# EAGLE design teensy_relay_controller (EAGLE 6.4)
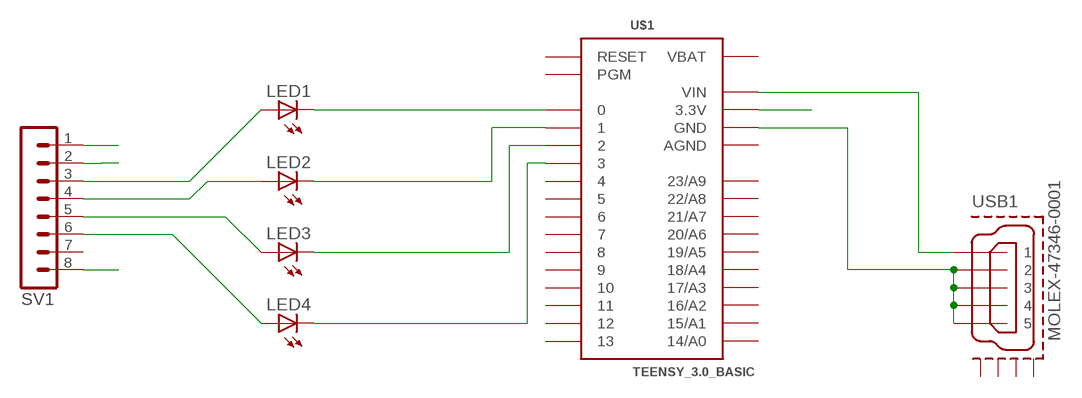
[diagram p0: schematic, sheet 1]

## Parts
LED1  LED5MM  [LED5MM]
LED2  LED5MM  [LED5MM]
LED3  LED5MM  [LED5MM]
LED4  LED5MM  [LED5MM]
SV1  MA08-1  [MA08-1]
U$1  TEENSY_3.0_BASIC  [TEENSY_3.0_BASIC]
USB1  MOLEX-47346-0001  [MOLEX-47364-0001]

## Nets
3.3V_VCC: SV1.2 U$1.3.3V U$1.3.3V1(3.3V)
5V_VCC: SV1.1 U$1.VIN USB1.1
_RELAY3: LED2.A SV1.4
_RELAY4: LED1.K(C) U$1.0
GND: SV1.8 U$1.GND U$1.GND1(GND) USB1.2 USB1.3 USB1.4 USB1.5
N$2: LED2.K(C) U$1.1
N$3: LED3.K(C) U$1.2
N$4: LED4.K(C) U$1.3
N$5: LED1.A SV1.3
N$6: LED3.A SV1.5
N$7: LED4.A SV1.6
Unconnected: SV1.7 U$1.4 U$1.5 U$1.6 U$1.7 U$1.8 U$1.9 U$1.10 U$1.11 U$1.12 U$1.13 U$1.14/A0 U$1.15/A1 U$1.16/A2 U$1.17/A3 U$1.18/A4 U$1.19/A5 U$1.20/A6 U$1.21/A7 U$1.22/A8 U$1.23/A9 U$1.PGM U$1.RESET USB1.GND1 USB1.GND2 USB1.GND3 USB1.GND4

## Power pins joined to a net without a drawn wire
AGND: U$1.AGND
VBAT: U$1.VBAT

## Library data of the parts
LED1-LED4 = led:LED: LED OSRAM: - CHIPLED LG R971, LG N971, LY N971, LG Q971, LY Q971, LO R971, LY R971 LH N974, LH R974 LS Q976, LO Q976, LY Q976 LO Q996 - Hyper CHIPLED LW Q18S LB Q993, LB Q99A, LB R99A - SideLED LS A670, LO A670, LY A670, LG A670, LP A670 LB A673, LV A673, LT A673, LW A673 LH A674 LY A675 LS A676, LA A676, LO A676, LY A676, LW A676 LS A679, LY A679, LG A679 - Hyper Micro SIDELED® LS Y876, LA Y876, LO Y876, LY Y876 LT Y87S - SmartLED LW L88C, LW L88S LB L89C, LB L89S, LG L890 LS L89K, LO L89K, LY L89K LS L896, LA L896, LO L896, LY L896 - TOPLED LS T670, LO T670, LY T670, LG T670, LP T670 LSG T670, LSP T670, LSY T670, LOP T670, LYG T670 LG T671, LOG T671, LSG T671 LB T673, LV T673, LT T673, LW T673 LH T674 LS T676, LA T676, LO T676, LY T676, LB T676, LH T676, LSB T676, LW T676 LB T67C, LV T67C, LT T67C, LS T67K, LO T67K, LY T67K, LW E67C LS E67B, LA E67B, LO E67B, LY E67B, LB E67C, LV E67C, LT E67C LW T67C LS T679, LY T679, LG T679 LS T770, LO T770, LY T770, LG T770, LP T770 LB T773, LV T773, LT T773, LW T773 LH T774 LS E675, LA E675, LY E675, LS T675 LS T776, LA T776, LO T776, LY T776, LB T776 LHGB T686 LT T68C, LB T68C - Hyper Mini TOPLED® LB M676 - Mini TOPLED Santana® LG M470 LS M47K, LO M47K, LY M47K Source: http://www.osram.convergy.de LUXEON: - LUMILED® LXK2-PW12-R00, LXK2-PW12-S00, LXK2-PW14-U00, LXK2-PW14-V00 LXK2-PM12-R00, LXK2-PM12-S00, LXK2-PM14-U00 LXK2-PE12-Q00, LXK2-PE12-R00, LXK2-PE12-S00, LXK2-PE14-T00, LXK2-PE14-U00 LXK2-PB12-K00, LXK2-PB12-L00, LXK2-PB12-M00, LXK2-PB14-N00, LXK2-PB14-P00, LXK2-PB14-Q00 LXK2-PR12-L00, LXK2-PR12-M00, LXK2-PR14-Q00, LXK2-PR14-R00 LXK2-PD12-Q00, LXK2-PD12-R00, LXK2-PD12-S00 LXK2-PH12-R00, LXK2-PH12-S00 LXK2-PL12-P00, LXK2-PL12-Q00, LXK2-PL12-R00 Source: www.luxeon.com KINGBRIGHT: KA-3528ASYC Source: www.kingbright.com
SV1 = con-lstb:MA08-1: PIN HEADER; OC_FARNELL: unknown; OC_NEWARK: unknown
U$1 = Teensy3.0:TEENSY_3.0_BASIC: Basic Teensy 3.0 with none of the 'inner' pins enabled. See '+4', 'AllAnalogPins", and 'AllPins' packages for additional pin holes, as needed.
USB1 = usb_con-update:MOLEX-47346-0001: MICRO USB B, BOTTOM MOUNT

## Board
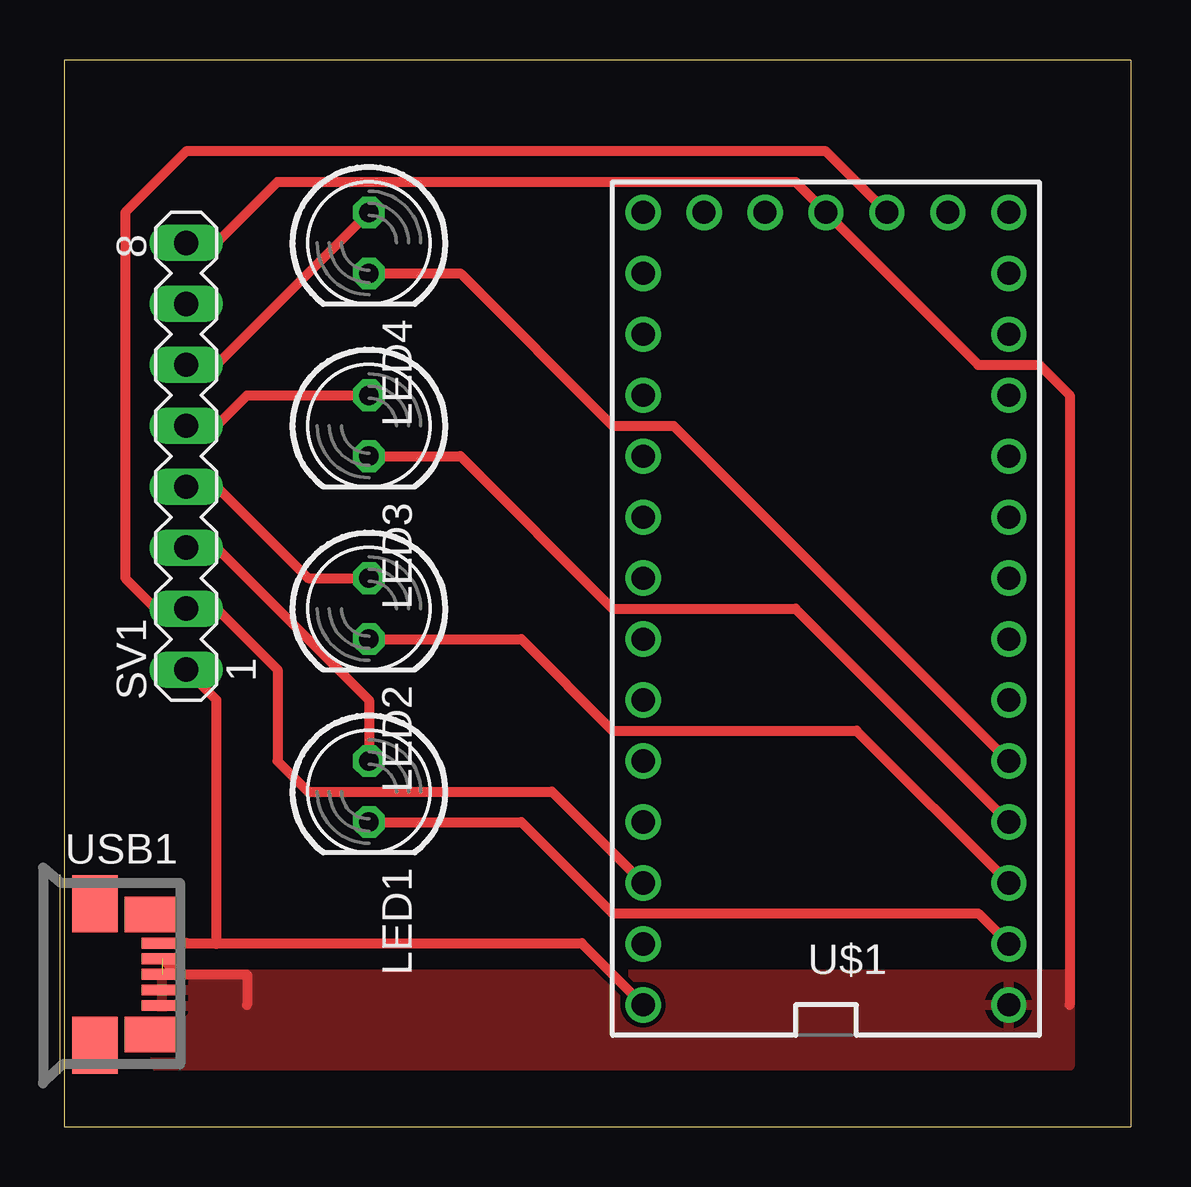
[diagram p1: board, top side]

Size 44.45 x 44.45 mm. Coordinates in mm from the lower left corner, seen from the top.
Outline: 0,0 44.45,0 44.45,44.45 0,44.45 0,0
Copper layers (1*16): Top 0.035mm / dielectric 1.5mm / Bottom 0.035mm
Design rules "default": minimum track width 10mil, minimum drill 24mil, track to track 8mil, track to pad 8mil, pad to pad 8mil, via to via 8mil, smd to smd 8mil, copper to edge 40mil, drill to drill 8mil, minimum pad ring 10mil, minimum via ring 8mil, stop-mask expansion 4mil, vias tented up to drill 0mil, thermal gap 10mil

### Footprints (pad centres in the part's own frame; a part is rotated, then mirrored left to right if it is on the bottom)
LED5MM = drill 0.813 octagon: A -1.27,0; K 1.27,0
MA08-1 = drill 1.016 long: 1 -8.89,0; 2 -6.35,0; 3 -3.81,0; 4 -1.27,0; 5 1.27,0; 6 3.81,0; 7 6.35,0; 8 8.89,0
TEENSY_3.0_BASIC = drill 0.965: 0 -7.62,13.97; 1 -7.62,11.43; 2 -7.62,8.89; 3 -7.62,6.35; 3.3V 7.62,11.43; 3.3V1 -2.54,-16.51; 4 -7.62,3.81; 5 -7.62,1.27; 6 -7.62,-1.27; 7 -7.62,-3.81; 8 -7.62,-6.35; 9 -7.62,-8.89; 10 -7.62,-11.43; 11 -7.62,-13.97; 12 -7.62,-16.51; 13 7.62,-16.51; 14/A0 7.62,-13.97; 15/A1 7.62,-11.43; 16/A2 7.62,-8.89; 17/A3 7.62,-6.35; 18/A4 7.62,-3.81; 19/A5 7.62,-1.27; 20/A6 7.62,1.27; 21/A7 7.62,3.81; 22/A8 7.62,6.35; 23/A9 7.62,8.89; AGND 7.62,13.97; GND -7.62,16.51; GND1 0,-16.51; PGM 2.54,-16.51; RESET 5.08,-16.51; VBAT -5.08,-16.51; VIN 7.62,16.51
MOLEX-47364-0001 = smd 1.7 x 0.45: 1 2.8,1.3; 2 2.8,0.65; 3 2.8,0; 4 2.8,-0.65; 5 2.8,-1.3 | smd 1.9 x 2.375: GND1 0,2.95; GND4 0,-2.95 | smd 2.1 x 1.475: GND2 2.3,2.5; GND3 2.3,-2.5

### Placement (x,y rotation side)
LED1  12.7,13.97 270 top
LED2  12.7,21.59 270 top
LED3  12.7,29.21 270 top
LED4  12.7,36.83 270 top
SV1  5.08,27.94 90 top
U$1  31.75,21.59 180 top
USB1  1.27,6.35 0 top

### Tracks (layer width: path | path; a pad name or v marks a point on that pad's centre or on a via)
3.3V_VCC
  Top 0.406: U$1.3.3V1 31.75,40.64 5.08,40.64 2.54,38.1 2.54,22.86 3.81,21.59 SV1.2 6.35,21.59 8.89,19.05 8.89,15.24 10.16,13.97 20.32,13.97 U$1.3.3V
5V_VCC
  Top 0.406: SV1.1 6.35,17.78 6.35,7.62 5.11,7.65 USB1.1 21.56,7.65 U$1.VIN
_RELAY3
  Top 0.406: SV1.4 6.35,26.67 10.16,22.86 LED2.A
_RELAY4
  Top 0.406: LED1.K 19.05,12.7 22.86,8.89 38.1,8.89 U$1.0
GND  (1 unrouted)
  Top 0.406: SV1.8 6.35,36.83 8.89,39.37 30.48,39.37 U$1.GND1 38.1,31.75 40.64,31.75 41.91,30.48 41.91,5.08 | USB1.2 4.72,6.35 7.62,6.35 7.62,5.08
  pour Top: 3.81,6.35 41.91,6.35 41.91,3.81 41.91,2.54 3.81,2.54
N$2
  Top 0.406: LED2.K 19.05,20.32 22.86,16.51 33.02,16.51 U$1.1
N$3
  Top 0.406: LED3.K 16.51,27.94 22.86,21.59 30.48,21.59 U$1.2
N$4
  Top 0.406: LED4.K 16.51,35.56 22.86,29.21 25.4,29.21 U$1.3
N$5
  Top 0.406: SV1.3 6.35,24.13 12.7,17.78 LED1.A
N$6
  Top 0.406: SV1.5 6.35,29.21 7.62,30.48 LED3.A
N$7
  Top 0.406: SV1.6 6.35,31.75 LED4.A